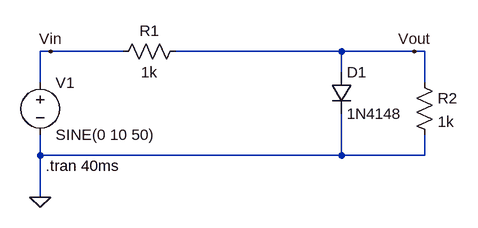
[diagram p0: schematic Diode application.asc]
Diode application.asc, the LTspice schematic file:
Version 4.1
SHEET 1 880 680
WIRE -16 64 -32 64
WIRE 96 64 -16 64
WIRE 432 64 176 64
WIRE 544 64 432 64
WIRE 560 64 544 64
WIRE 432 96 432 64
WIRE -32 112 -32 64
WIRE 560 112 560 64
WIRE -32 224 -32 192
WIRE 432 224 432 160
WIRE 432 224 -32 224
WIRE 560 224 560 192
WIRE 560 224 432 224
WIRE -32 288 -32 224
FLAG -32 288 0
FLAG -16 64 Vin
FLAG 544 64 Vout
SYMBOL voltage -32 96 R0
WINDOW 123 0 0 Left 0
WINDOW 39 0 0 Left 0
SYMATTR InstName V1
SYMATTR Value SINE(0 10 50)
SYMBOL res 192 48 R90
WINDOW 0 0 56 VBottom 2
WINDOW 3 32 56 VTop 2
SYMATTR InstName R1
SYMATTR Value 1k
SYMBOL res 544 96 R0
SYMATTR InstName R2
SYMATTR Value 1k
SYMBOL diode 416 96 R0
SYMATTR InstName D1
SYMATTR Value 1N4148
TEXT -24 240 Left 2 !.tran 40ms

The netlist it stands for:
* Diode application.asc
V1 Vin 0 SINE(0 10 50)
R1 Vout Vin 1k
R2 Vout 0 1k
D1 Vout 0 1N4148
.model D D
.lib standard.dio
.tran 40ms
.backanno
.end